# Altium schematic sheet Z_modem.SchDoc
size A4
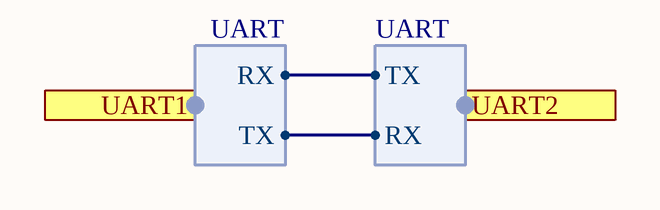
[diagram p0: Z_modem.SchDoc]

## Ports
UART1 (harness UART), UART2 (harness UART)

## Harnesses
UART: RX, TX

## Nets
(unnamed): port UART2.RX, port UART1.TX
(unnamed): port UART2.TX, port UART1.RX